# Altium schematic sheet robotcar.SchDoc
size A3
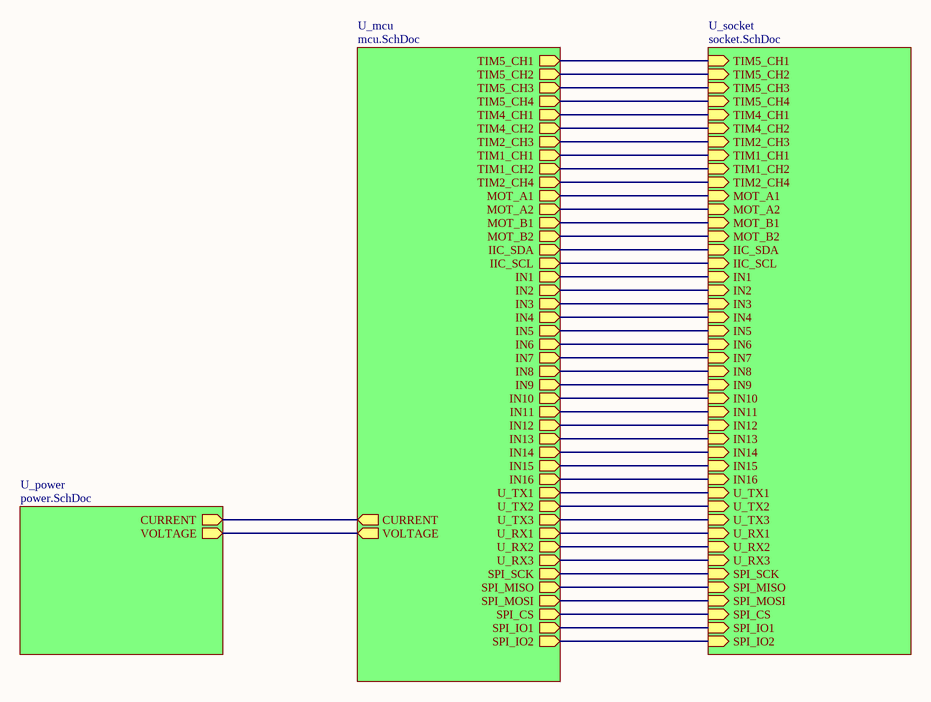
[diagram p0: robotcar.SchDoc]

## Sub-sheets
U_mcu = mcu.SchDoc: TIM5_CH1 (out), TIM5_CH2 (out), TIM5_CH3 (out), TIM5_CH4 (out), TIM4_CH1 (out), TIM4_CH2 (out), TIM2_CH3 (out), TIM1_CH1 (out), TIM1_CH2 (out), TIM2_CH4 (out), MOT_A1 (out), MOT_A2 (out), MOT_B1 (out), MOT_B2 (out), IIC_SDA (out), IIC_SCL (out), IN1 (out), IN2 (out), IN3 (out), IN4 (out), IN5 (out), IN6 (out), IN7 (out), IN8 (out), IN9 (out), IN10 (out), IN11 (out), IN12 (out), IN13 (out), IN14 (out), IN15 (out), IN16 (out), U_TX1 (out), U_TX2 (out), U_TX3 (out), U_RX1 (out), U_RX2 (out), U_RX3 (out), CURRENT (out), VOLTAGE (out), SPI_SCK (out), SPI_MISO (out), SPI_MOSI (out), SPI_CS (out), SPI_IO1 (out), SPI_IO2 (out)
U_power = power.SchDoc: CURRENT (out), VOLTAGE (out)
U_socket = socket.SchDoc: TIM5_CH1 (in), TIM5_CH2 (in), TIM5_CH3 (in), TIM5_CH4 (in), TIM4_CH1 (in), TIM4_CH2 (in), TIM2_CH3 (in), TIM1_CH1 (in), TIM1_CH2 (in), TIM2_CH4 (in), MOT_A1 (in), MOT_A2 (in), MOT_B1 (in), MOT_B2 (in), IIC_SDA (in), IIC_SCL (in), IN1 (in), IN2 (in), IN3 (in), IN4 (in), IN5 (in), IN6 (in), IN7 (in), IN8 (in), IN9 (in), IN10 (in), IN11 (in), IN12 (in), IN13 (in), IN14 (in), IN15 (in), IN16 (in), U_TX1 (in), U_TX2 (in), U_TX3 (in), U_RX1 (in), U_RX2 (in), U_RX3 (in), SPI_SCK (in), SPI_MISO (in), SPI_MOSI (in), SPI_CS (in), SPI_IO1 (in), SPI_IO2 (in)

## Nets
(unnamed): sheet U_socket/TIM5_CH1, sheet U_mcu/TIM5_CH1
(unnamed): sheet U_socket/TIM5_CH2, sheet U_mcu/TIM5_CH2
(unnamed): sheet U_socket/TIM5_CH3, sheet U_mcu/TIM5_CH3
(unnamed): sheet U_socket/TIM5_CH4, sheet U_mcu/TIM5_CH4
(unnamed): sheet U_socket/TIM4_CH1, sheet U_mcu/TIM4_CH1
(unnamed): sheet U_socket/TIM4_CH2, sheet U_mcu/TIM4_CH2
(unnamed): sheet U_socket/TIM2_CH3, sheet U_mcu/TIM2_CH3
(unnamed): sheet U_socket/TIM1_CH1, sheet U_mcu/TIM1_CH1
(unnamed): sheet U_socket/TIM1_CH2, sheet U_mcu/TIM1_CH2
(unnamed): sheet U_socket/TIM2_CH4, sheet U_mcu/TIM2_CH4
(unnamed): sheet U_socket/MOT_A1, sheet U_mcu/MOT_A1
(unnamed): sheet U_socket/MOT_A2, sheet U_mcu/MOT_A2
(unnamed): sheet U_socket/MOT_B1, sheet U_mcu/MOT_B1
(unnamed): sheet U_socket/MOT_B2, sheet U_mcu/MOT_B2
(unnamed): sheet U_socket/IIC_SDA, sheet U_mcu/IIC_SDA
(unnamed): sheet U_socket/IIC_SCL, sheet U_mcu/IIC_SCL
(unnamed): sheet U_socket/IN1, sheet U_mcu/IN1
(unnamed): sheet U_socket/IN2, sheet U_mcu/IN2
(unnamed): sheet U_socket/IN3, sheet U_mcu/IN3
(unnamed): sheet U_socket/IN4, sheet U_mcu/IN4
(unnamed): sheet U_socket/IN5, sheet U_mcu/IN5
(unnamed): sheet U_socket/IN6, sheet U_mcu/IN6
(unnamed): sheet U_socket/IN7, sheet U_mcu/IN7
(unnamed): sheet U_socket/IN8, sheet U_mcu/IN8
(unnamed): sheet U_socket/IN9, sheet U_mcu/IN9
(unnamed): sheet U_socket/IN10, sheet U_mcu/IN10
(unnamed): sheet U_socket/IN11, sheet U_mcu/IN11
(unnamed): sheet U_socket/IN12, sheet U_mcu/IN12
(unnamed): sheet U_socket/IN13, sheet U_mcu/IN13
(unnamed): sheet U_socket/IN14, sheet U_mcu/IN14
(unnamed): sheet U_socket/IN15, sheet U_mcu/IN15
(unnamed): sheet U_socket/IN16, sheet U_mcu/IN16
(unnamed): sheet U_socket/U_TX1, sheet U_mcu/U_TX1
(unnamed): sheet U_socket/U_TX2, sheet U_mcu/U_TX2
(unnamed): sheet U_socket/U_TX3, sheet U_mcu/U_TX3
(unnamed): sheet U_socket/U_RX1, sheet U_mcu/U_RX1
(unnamed): sheet U_socket/U_RX2, sheet U_mcu/U_RX2
(unnamed): sheet U_socket/U_RX3, sheet U_mcu/U_RX3
(unnamed): sheet U_socket/SPI_SCK, sheet U_mcu/SPI_SCK
(unnamed): sheet U_socket/SPI_MISO, sheet U_mcu/SPI_MISO
(unnamed): sheet U_socket/SPI_MOSI, sheet U_mcu/SPI_MOSI
(unnamed): sheet U_socket/SPI_CS, sheet U_mcu/SPI_CS
(unnamed): sheet U_socket/SPI_IO1, sheet U_mcu/SPI_IO1
(unnamed): sheet U_socket/SPI_IO2, sheet U_mcu/SPI_IO2
(unnamed): sheet U_mcu/CURRENT, sheet U_power/CURRENT
(unnamed): sheet U_mcu/VOLTAGE, sheet U_power/VOLTAGE